# Altium schematic sheet FPGA_IO.SchDoc
size 863 x 558 mm; SheetNumber: 9; SheetTotal: 25; Sheet_Name: FPGA IO BANKS; Size: 11x17
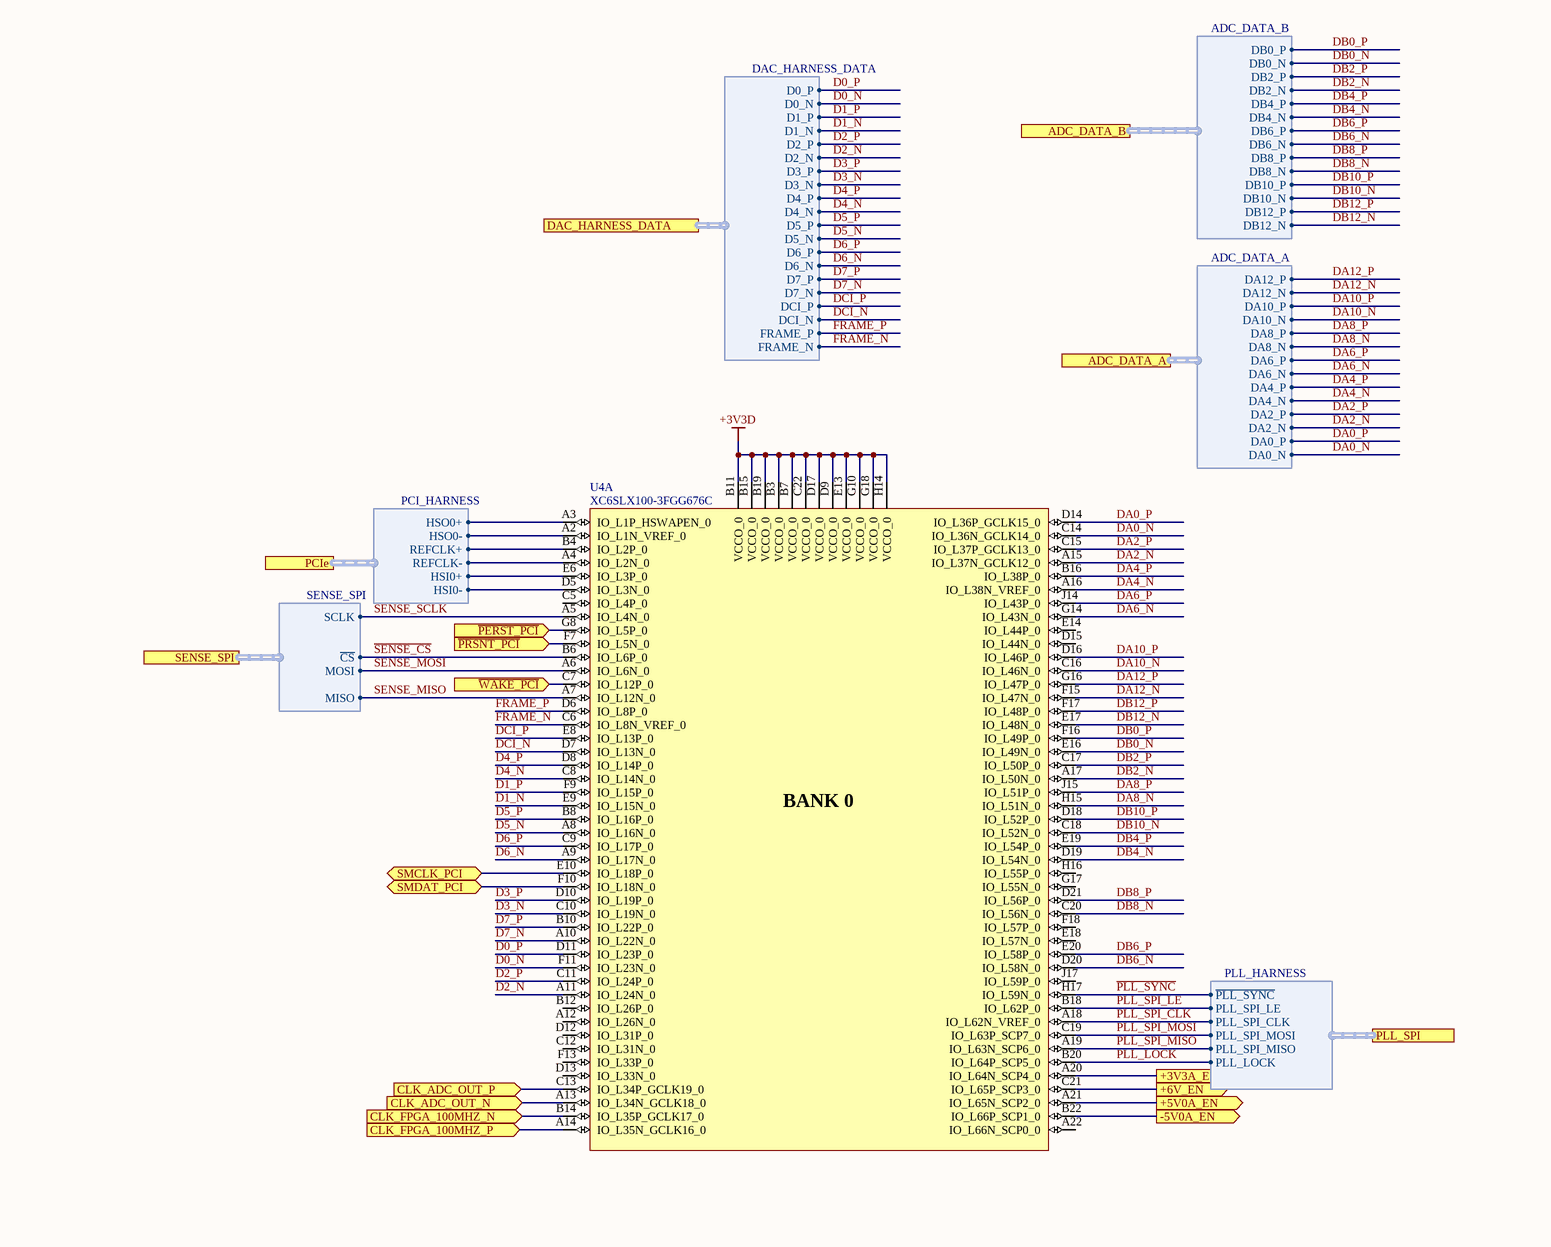
[diagram p0: FPGA_IO.SchDoc, top left]
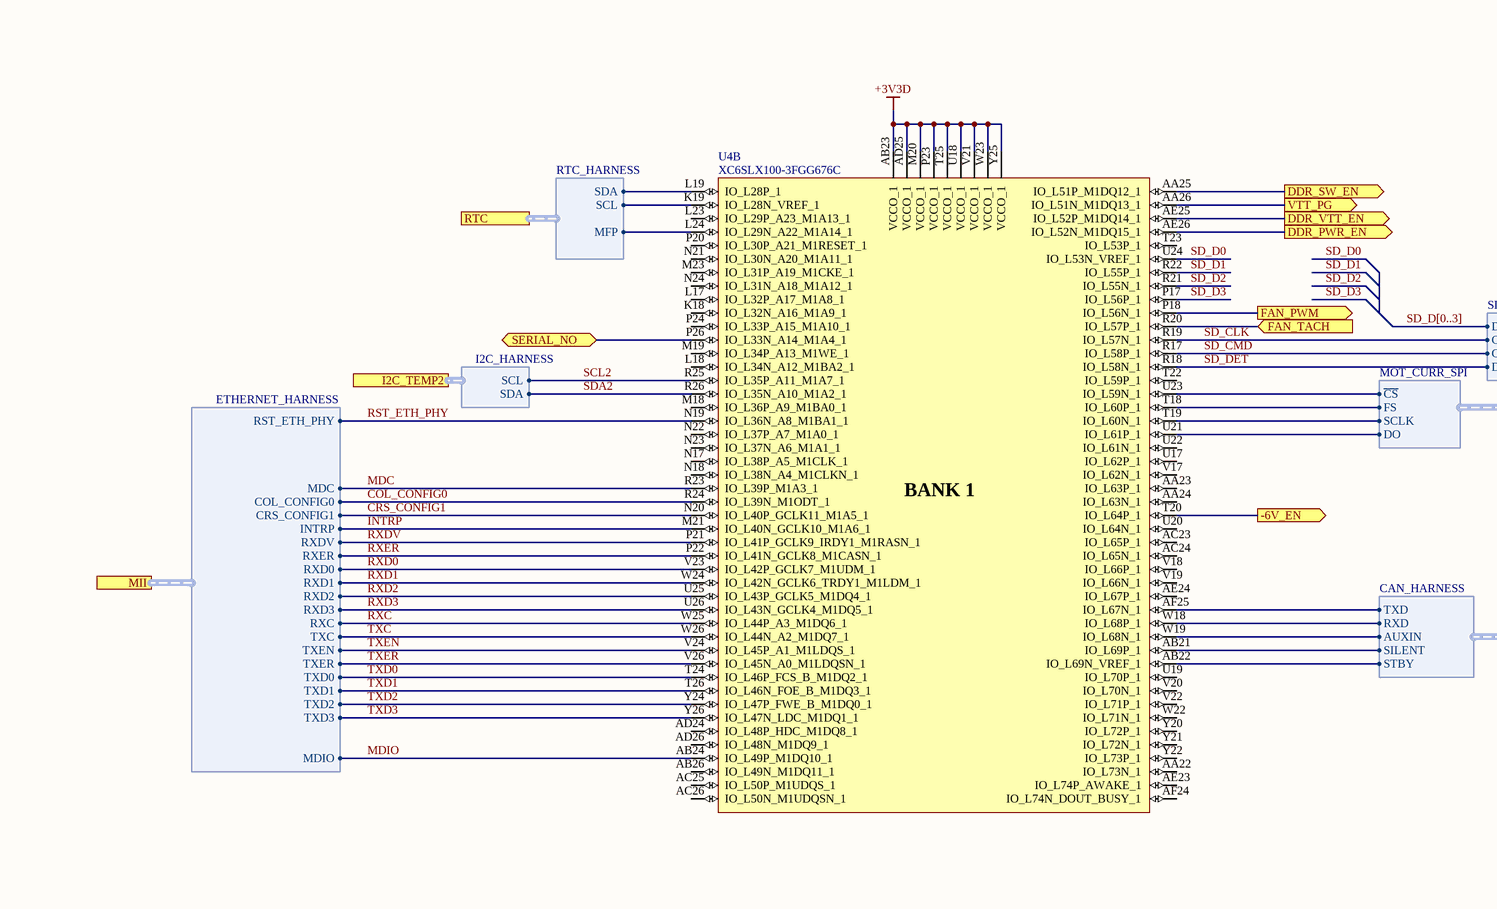
[diagram p1: FPGA_IO.SchDoc, top middle]
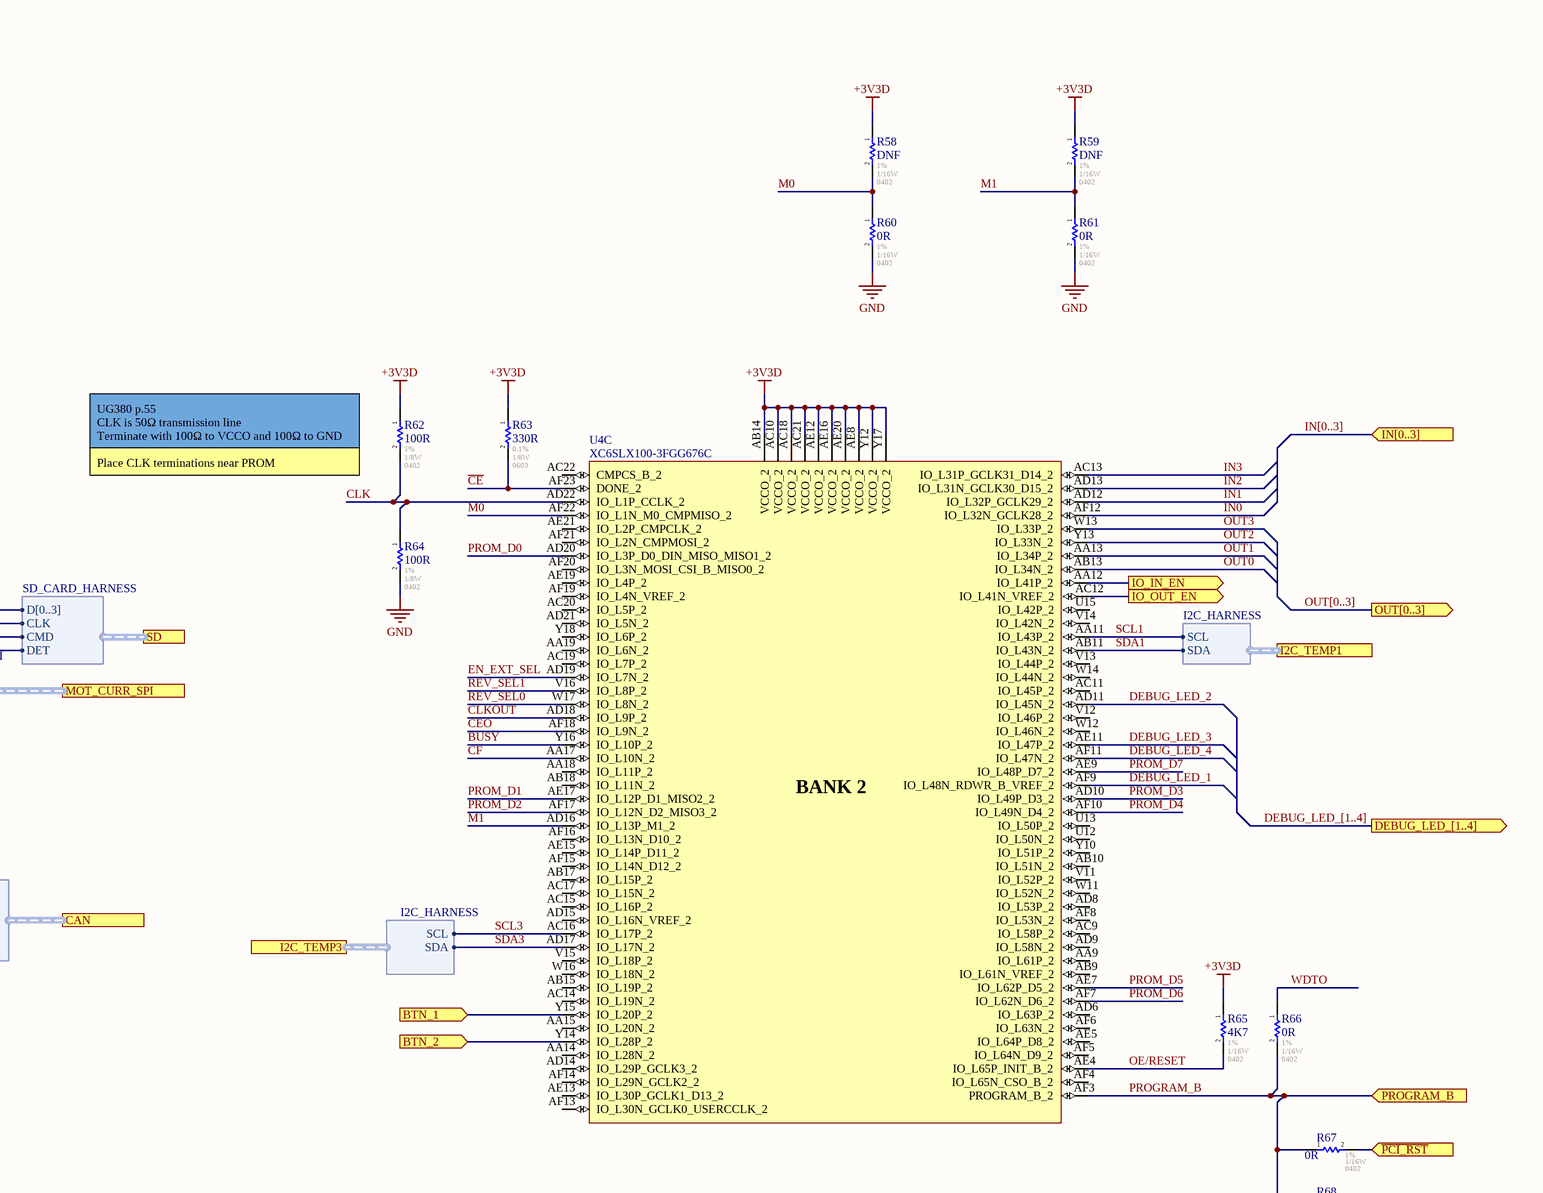
[diagram p2: FPGA_IO.SchDoc, top right]
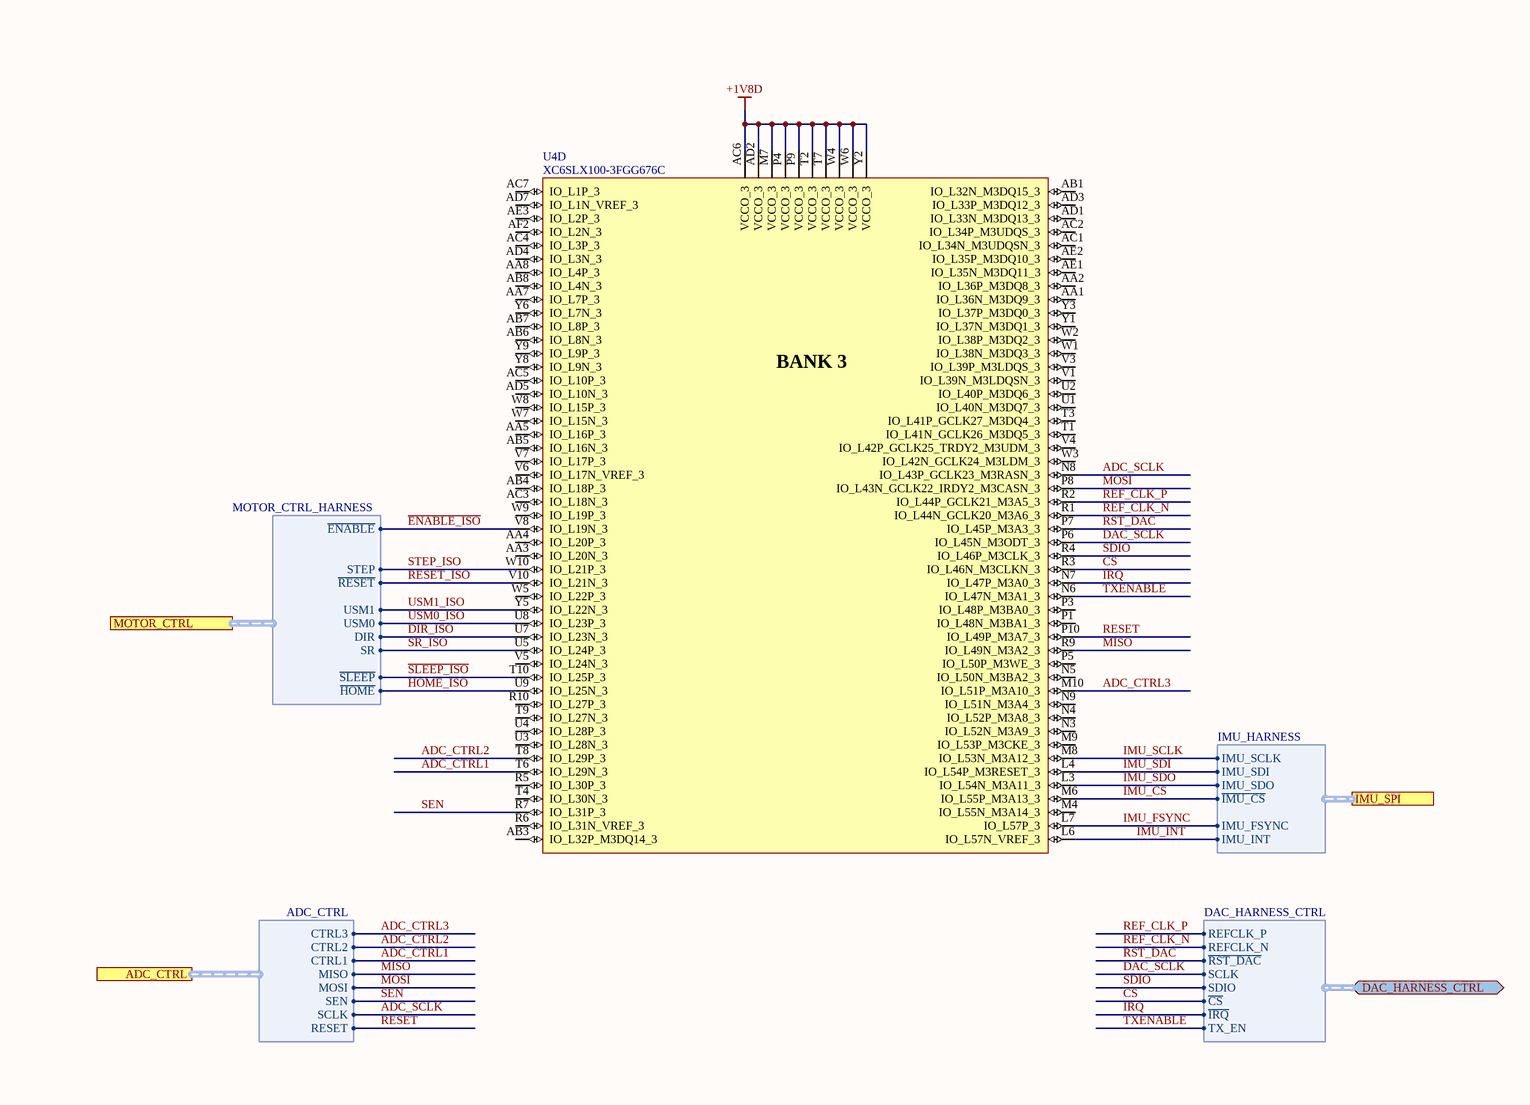
[diagram p3: FPGA_IO.SchDoc, bottom left]
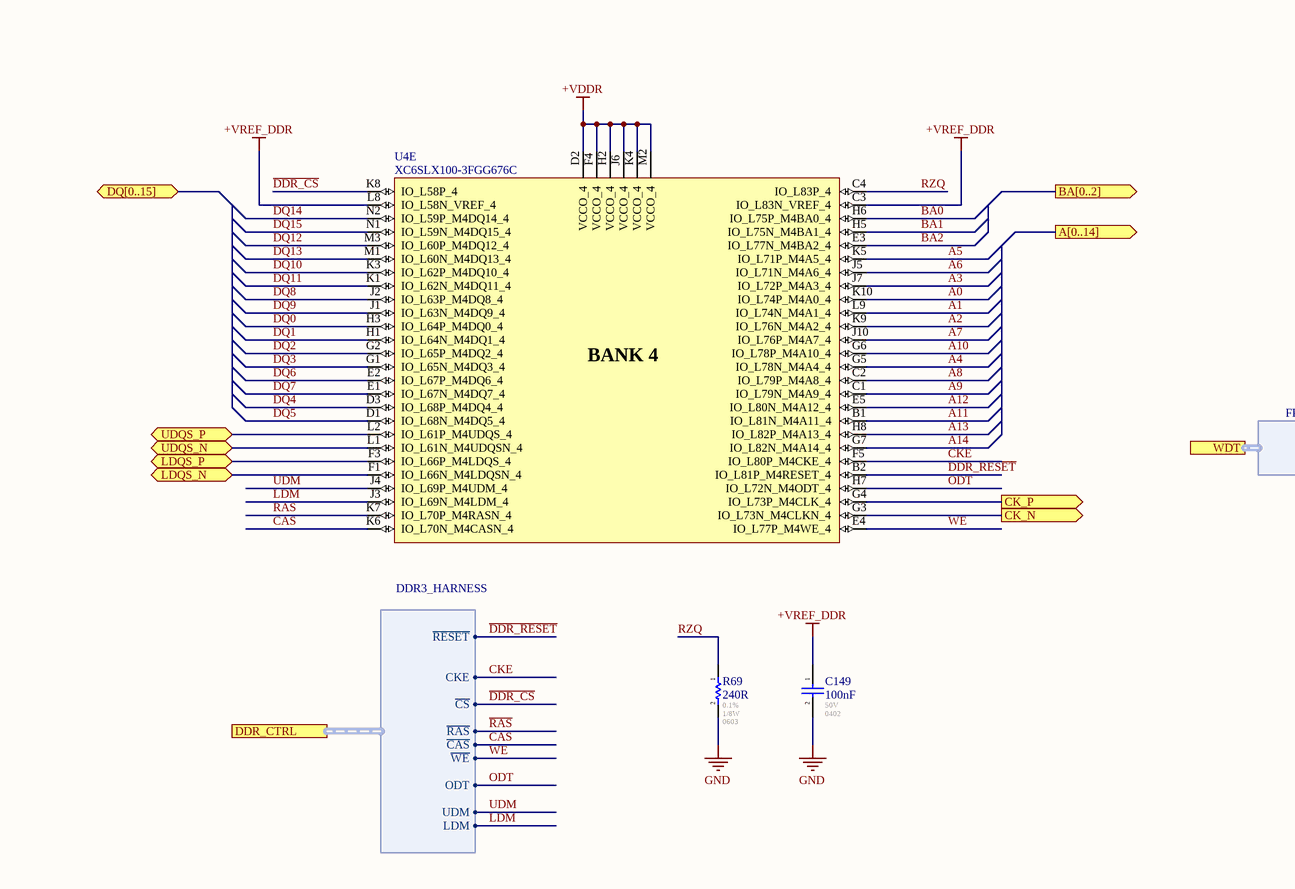
[diagram p4: FPGA_IO.SchDoc, bottom middle]
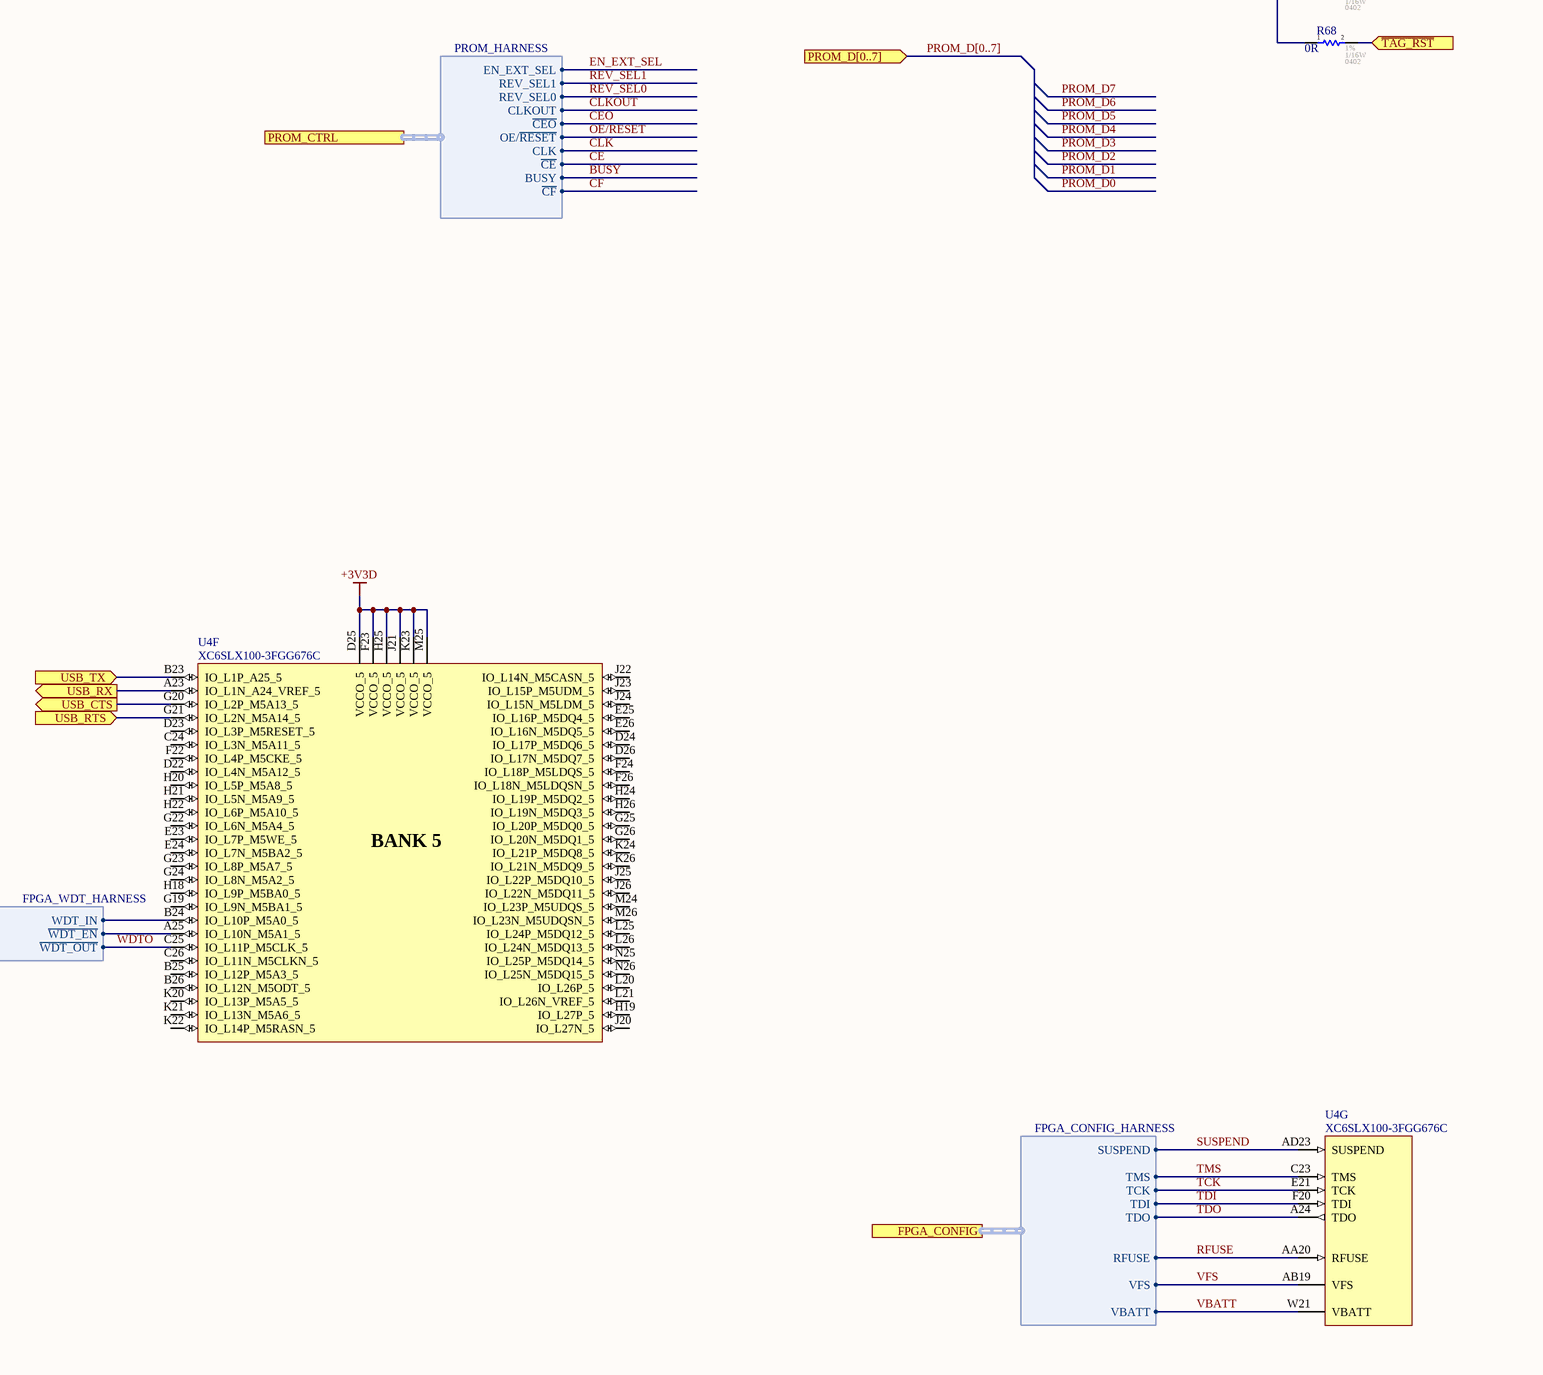
[diagram p5: FPGA_IO.SchDoc, bottom right]

## Parts
C149  100nF  Voltage - Rated: 50V  Footprint: 0402  [CAP_0402]
R58  DNF  Tolerance: 1%  Power: 1/16W  Package / Case: 0402  [RES_0402]
R59  DNF  Tolerance: 1%  Power: 1/16W  Package / Case: 0402  [RES_0402]
R60  0R  Tolerance: 1%  Power: 1/16W  Package / Case: 0402  [RES_0402]
R61  0R  Tolerance: 1%  Power: 1/16W  Package / Case: 0402  [RES_0402]
R62  100R  Tolerance: 1%  Power: 1/8W  Package / Case: 0402  [RES_0402]
R63  330R  Tolerance: 0.1%  Power: 1/8W  Package / Case: 0603  [RES_0603]
R64  100R  Tolerance: 1%  Power: 1/8W  Package / Case: 0402  [RES_0402]
R65  4K7  Tolerance: 1%  Power: 1/16W  Package / Case: 0402  [RES_0402]
R66  0R  Tolerance: 1%  Power: 1/16W  Package / Case: 0402  [RES_0402]
R67  0R  Tolerance: 1%  Power: 1/16W  Package / Case: 0402  [RES_0402]
R68  0R  Tolerance: 1%  Power: 1/16W  Package / Case: 0402  [RES_0402]
R69  240R  Tolerance: 0.1%  Power: 1/8W  Package / Case: 0603  [RES_0603]
U4  XC6SLX100-3FGG676C  [FPGA_XILINX_FGG676]  (parts A,B,C,D,E,F,G of 10)

## Ports
+3V3A_EN (out), +5V0A_EN (out), +6V_EN (out), -5V0A_EN (out), -6V_EN (out), A[0..14] (out), ADC_CTRL (harness ADC_CTRL), ADC_DATA_A (harness ADC_DATA_A), ADC_DATA_B (harness ADC_DATA_B), BA[0..2] (out), BTN_1 (in), BTN_2 (in), CAN (harness CAN_HARNESS), CK_N (out), CK_P (out), CLK_ADC_OUT_N (in), CLK_ADC_OUT_P (in), CLK_FPGA_100MHZ_N (in), CLK_FPGA_100MHZ_P (in), DAC_HARNESS_CTRL (bidir, harness DAC_HARNESS_CTRL), DAC_HARNESS_DATA (harness DAC_HARNESS_DATA), DDR_CTRL (harness DDR3_HARNESS), DDR_PWR_EN (out), DDR_SW_EN (out), DDR_VTT_EN (out), DEBUG_LED_[1..4] (out), DQ[0..15] (bidir), FAN_PWM (out), FAN_TACH (in), FPGA_CONFIG (harness FPGA_CONFIG_HARNESS), I2C_TEMP1 (harness I2C_HARNESS), I2C_TEMP2 (harness I2C_HARNESS), I2C_TEMP3 (harness I2C_HARNESS), IMU_SPI (harness IMU_HARNESS), IN[0..3] (in), IO_IN_EN (out), IO_OUT_EN (out), LDQS_N (bidir), LDQS_P (bidir), MII (harness ETHERNET_HARNESS), MOT_CURR_SPI (harness MOT_CURR_SPI), MOTOR_CTRL (harness MOTOR_CTRL_HARNESS), OUT[0..3] (out), PCIe (harness PCI_HARNESS), PLL_SPI (harness PLL_HARNESS), PROGRAM_B (in), PROM_CTRL (harness PROM_HARNESS), PROM_D[0..7] (in), RTC (harness RTC_HARNESS), SD (harness SD_CARD_HARNESS), SENSE_SPI (harness SENSE_SPI), SERIAL_NO (bidir), SMCLK_PCI (bidir), SMDAT_PCI (bidir), UDQS_N (bidir), UDQS_P (bidir), USB_CTS (out), USB_RTS (in), USB_RX (out), USB_TX (in), VTT_PG (out), WDT (harness FPGA_WDT_HARNESS), ~{PCI_RST} (in), ~{PERST_PCI} (in), ~{PRSNT_PCI} (in), ~{TAG_RST} (in), ~{WAKE_PCI} (in)

## Harnesses
DDR3_HARNESS: ~{RESET}, CKE, ~{CS}, ~{RAS}, ~{CAS}, ~{WE}, ODT, UDM, LDM
DAC_HARNESS_DATA: D0_N, D0_P, D1_P, D1_N, D2_P, D2_N, D3_P, D3_N, D4_P, D4_N, D5_P, D5_N, D6_P, D6_N, D7_P, D7_N, DCI_P, DCI_N, FRAME_P, FRAME_N
ADC_DATA_A: DA0_P, DA0_N, DA2_P, DA2_N, DA4_P, DA4_N, DA6_P, DA6_N, DA8_P, DA8_N, DA10_P, DA10_N, DA12_P, DA12_N
ADC_DATA_B: DB0_P, DB0_N, DB2_P, DB2_N, DB4_P, DB4_N, DB6_P, DB6_N, DB8_P, DB8_N, DB10_P, DB10_N, DB12_P, DB12_N
ADC_CTRL: RESET, SCLK, SEN, MOSI, MISO, CTRL1, CTRL2, CTRL3
PROM_HARNESS: EN_EXT_SEL, REV_SEL1, REV_SEL0, CLKOUT, ~{CEO}, OE/~{RESET}, CLK, ~{CE}, BUSY, ~{CF}
ETHERNET_HARNESS: MDIO, MDC, COL_CONFIG0, CRS_CONFIG1, INTRP, RXDV, RXER, RXD0, RXD1, RXD2, RXD3, RXC, TXEN, TXER, TXD0, TXD1, TXD2, TXD3, TXC, RST_ETH_PHY
MOTOR_CTRL_HARNESS: DIR, SR, STEP, ~{SLEEP}, ~{HOME}, USM1, USM0, ~{RESET}, ~{ENABLE}
PLL_HARNESS: ~{PLL_SYNC}, PLL_SPI_LE, PLL_SPI_CLK, PLL_SPI_MOSI, PLL_SPI_MISO, PLL_LOCK
FPGA_CONFIG_HARNESS: TCK, TDO, TDI, SUSPEND, TMS, RFUSE, VFS, VBATT
SENSE_SPI: ~{CS}, MISO, MOSI, SCLK
I2C_HARNESS: SDA, SCL
MOT_CURR_SPI: ~{CS}, FS, SCLK, DO
SD_CARD_HARNESS: CLK, CMD, D[0..3], DET
DAC_HARNESS_CTRL: ~{RST_DAC}, SCLK, SDIO, ~{CS}, ~{IRQ}, TX_EN, REFCLK_P, REFCLK_N
FPGA_WDT_HARNESS: WDT_IN, ~{WDT_EN}, ~{WDT_OUT}
PCI_HARNESS: HSI0+, HSI0-, HSO0+, HSO0-, REFCLK+, REFCLK-
CAN_HARNESS: TXD, RXD, AUXIN, SILENT, STBY
IMU_HARNESS: IMU_SCLK, IMU_SDI, IMU_SDO, ~{IMU_CS}, IMU_FSYNC, IMU_INT
RTC_HARNESS: SDA, SCL, MFP

## Nets
+1V8D: U4.AC6(VCCO_3) U4.AD2(VCCO_3) U4.M7(VCCO_3) U4.P4(VCCO_3) U4.P9(VCCO_3) U4.T2(VCCO_3) U4.T7(VCCO_3) U4.W4(VCCO_3) U4.W6(VCCO_3) U4.Y2(VCCO_3)
+3V3D: R58.1 R59.1 R62.1 R63.1 R65.1 U4.AB14(VCCO_2) U4.AB23(VCCO_1) U4.AC10(VCCO_2) U4.AC18(VCCO_2) U4.AC21(VCCO_2) U4.AD25(VCCO_1) U4.AE8(VCCO_2) U4.AE12(VCCO_2) U4.AE16(VCCO_2) U4.AE20(VCCO_2) U4.B3(VCCO_0) U4.B7(VCCO_0) U4.B11(VCCO_0) U4.B15(VCCO_0) U4.B19(VCCO_0) U4.C22(VCCO_0) U4.D9(VCCO_0) U4.D17(VCCO_0) U4.D25(VCCO_5) U4.E13(VCCO_0) U4.F23(VCCO_5) U4.G10(VCCO_0) U4.G18(VCCO_0) U4.H14(VCCO_0) U4.H25(VCCO_5) U4.J21(VCCO_5) U4.K23(VCCO_5) U4.M20(VCCO_1) U4.M25(VCCO_5) U4.P23(VCCO_1) U4.T25(VCCO_1) U4.U18(VCCO_1) U4.V21(VCCO_1) U4.W23(VCCO_1) U4.Y12(VCCO_2) U4.Y17(VCCO_2) U4.Y25(VCCO_1)
+VDDR: U4.D2(VCCO_4) U4.F4(VCCO_4) U4.H2(VCCO_4) U4.J6(VCCO_4) U4.K4(VCCO_4) U4.M2(VCCO_4)
+VREF_DDR: C149.1 U4.C3(IO_L83N_VREF_4) U4.L8(IO_L58N_VREF_4)
GND: C149.2 R60.2 R61.2 R64.2 R69.2
+3V3A_EN: U4.A20(IO_L64N_SCP4_0) ; port +3V3A_EN
+5V0A_EN: U4.A21(IO_L65N_SCP2_0) ; port +5V0A_EN
+6V_EN: U4.C21(IO_L65P_SCP3_0) ; port +6V_EN
-5V0A_EN: U4.B22(IO_L66P_SCP1_0) ; port -5V0A_EN
-6V_EN: U4.T20(IO_L64P_1) ; port -6V_EN
~{CAS}: U4.K6(IO_L70N_M4CASN_4) ; port DDR_CTRL.~{CAS}
~{CE}: R63.2 U4.AF23(DONE_2) ; port PROM_CTRL.~{CE}
~{CEO}: U4.AF18(IO_L9N_2) ; port PROM_CTRL.~{CEO}
~{CF}: U4.AA17(IO_L10N_2) ; port PROM_CTRL.~{CF}
~{CS}: U4.R3(IO_L46N_M3CLKN_3) ; port DAC_HARNESS_CTRL.~{CS}
~{DDR_CS}: U4.K8(IO_L58P_4) ; port DDR_CTRL.~{CS}
~{DDR_RESET}: U4.B2(IO_L81P_M4RESET_4) ; port DDR_CTRL.~{RESET}
~{ENABLE_ISO}: U4.V8(IO_L19N_3) ; port MOTOR_CTRL.~{ENABLE}
~{HOME_ISO}: U4.U9(IO_L25N_3) ; port MOTOR_CTRL.~{HOME}
~{IMU_CS}: U4.M6(IO_L55P_M3A13_3) ; port IMU_SPI.~{IMU_CS}
~{IRQ}: U4.N7(IO_L47P_M3A0_3) ; port DAC_HARNESS_CTRL.~{IRQ}
~{PCI_RST}: R67.2 ; port ~{PCI_RST}
~{PERST_PCI}: U4.G8(IO_L5P_0) ; port ~{PERST_PCI}
~{PLL_SYNC}: U4.H17(IO_L59N_0) ; port PLL_SPI.~{PLL_SYNC}
~{PRSNT_PCI}: U4.F7(IO_L5N_0) ; port ~{PRSNT_PCI}
~{RAS}: U4.K7(IO_L70P_M4RASN_4) ; port DDR_CTRL.~{RAS}
~{RESET_ISO}: U4.V10(IO_L21N_3) ; port MOTOR_CTRL.~{RESET}
~{RST_DAC}: U4.P7(IO_L45P_M3A3_3) ; port DAC_HARNESS_CTRL.~{RST_DAC}
~{SENSE_CS}: U4.B6(IO_L6P_0) ; port SENSE_SPI.~{CS}
~{SLEEP_ISO}: U4.T10(IO_L25P_3) ; port MOTOR_CTRL.~{SLEEP}
~{TAG_RST}: R68.2 ; port ~{TAG_RST}
~{WAKE_PCI}: U4.C7(IO_L12P_0) ; port ~{WAKE_PCI}
~{WE}: U4.E4(IO_L77P_M4WE_4) ; port DDR_CTRL.~{WE}
A0: U4.K10(IO_L74P_M4A0_4)
A1: U4.L9(IO_L74N_M4A1_4)
A2: U4.K9(IO_L76N_M4A2_4)
A3: U4.J7(IO_L72P_M4A3_4)
A4: U4.G5(IO_L78N_M4A4_4)
A5: U4.K5(IO_L71P_M4A5_4)
A6: U4.J5(IO_L71N_M4A6_4)
A7: U4.J10(IO_L76P_M4A7_4)
A8: U4.C2(IO_L79P_M4A8_4)
A9: U4.C1(IO_L79N_M4A9_4)
A10: U4.G6(IO_L78P_M4A10_4)
A11: U4.B1(IO_L81N_M4A11_4)
A12: U4.E5(IO_L80N_M4A12_4)
A13: U4.H8(IO_L82P_M4A13_4)
A14: U4.G7(IO_L82N_M4A14_4)
ADC_CTRL1: U4.T6(IO_L29N_3) ; port ADC_CTRL.CTRL1
ADC_CTRL2: U4.T8(IO_L29P_3) ; port ADC_CTRL.CTRL2
ADC_CTRL3: U4.M10(IO_L51P_M3A10_3) ; port ADC_CTRL.CTRL3
ADC_SCLK: U4.N8(IO_L43P_GCLK23_M3RASN_3) ; port ADC_CTRL.SCLK
BA0: U4.H6(IO_L75P_M4BA0_4)
BA1: U4.H5(IO_L75N_M4BA1_4)
BA2: U4.E3(IO_L77N_M4BA2_4)
BTN_1: U4.Y15(IO_L20P_2) ; port BTN_1
BTN_2: U4.Y14(IO_L28P_2) ; port BTN_2
BUSY: U4.Y16(IO_L10P_2) ; port PROM_CTRL.BUSY
CK_N: U4.G3(IO_L73N_M4CLKN_4) ; port CK_N
CK_P: U4.G4(IO_L73P_M4CLK_4) ; port CK_P
CKE: U4.F5(IO_L80P_M4CKE_4) ; port DDR_CTRL.CKE
CLK: R62.2 R64.1 U4.AD22(IO_L1P_CCLK_2) ; port PROM_CTRL.CLK
CLK_ADC_OUT_N: U4.A13(IO_L34N_GCLK18_0) ; port CLK_ADC_OUT_N
CLK_ADC_OUT_P: U4.C13(IO_L34P_GCLK19_0) ; port CLK_ADC_OUT_P
CLK_FPGA_100MHZ_N: U4.B14(IO_L35P_GCLK17_0) ; port CLK_FPGA_100MHZ_N
CLK_FPGA_100MHZ_P: U4.A14(IO_L35N_GCLK16_0) ; port CLK_FPGA_100MHZ_P
CLKOUT: U4.AD18(IO_L9P_2) ; port PROM_CTRL.CLKOUT
COL_CONFIG0: U4.R24(IO_L39N_M1ODT_1) ; port MII.COL_CONFIG0
CRS_CONFIG1: U4.N20(IO_L40P_GCLK11_M1A5_1) ; port MII.CRS_CONFIG1
D0_N: U4.F11(IO_L23N_0) ; port DAC_HARNESS_DATA.D0_N
D0_P: U4.D11(IO_L23P_0) ; port DAC_HARNESS_DATA.D0_P
D1_N: U4.E9(IO_L15N_0) ; port DAC_HARNESS_DATA.D1_N
D1_P: U4.F9(IO_L15P_0) ; port DAC_HARNESS_DATA.D1_P
D2_N: U4.A11(IO_L24N_0) ; port DAC_HARNESS_DATA.D2_N
D2_P: U4.C11(IO_L24P_0) ; port DAC_HARNESS_DATA.D2_P
D3_N: U4.C10(IO_L19N_0) ; port DAC_HARNESS_DATA.D3_N
D3_P: U4.D10(IO_L19P_0) ; port DAC_HARNESS_DATA.D3_P
D4_N: U4.C8(IO_L14N_0) ; port DAC_HARNESS_DATA.D4_N
D4_P: U4.D8(IO_L14P_0) ; port DAC_HARNESS_DATA.D4_P
D5_N: U4.A8(IO_L16N_0) ; port DAC_HARNESS_DATA.D5_N
D5_P: U4.B8(IO_L16P_0) ; port DAC_HARNESS_DATA.D5_P
D6_N: U4.A9(IO_L17N_0) ; port DAC_HARNESS_DATA.D6_N
D6_P: U4.C9(IO_L17P_0) ; port DAC_HARNESS_DATA.D6_P
D7_N: U4.A10(IO_L22N_0) ; port DAC_HARNESS_DATA.D7_N
D7_P: U4.B10(IO_L22P_0) ; port DAC_HARNESS_DATA.D7_P
DA0_N: U4.C14(IO_L36N_GCLK14_0) ; port ADC_DATA_A.DA0_N
DA0_P: U4.D14(IO_L36P_GCLK15_0) ; port ADC_DATA_A.DA0_P
DA2_N: U4.A15(IO_L37N_GCLK12_0) ; port ADC_DATA_A.DA2_N
DA2_P: U4.C15(IO_L37P_GCLK13_0) ; port ADC_DATA_A.DA2_P
DA4_N: U4.A16(IO_L38N_VREF_0) ; port ADC_DATA_A.DA4_N
DA4_P: U4.B16(IO_L38P_0) ; port ADC_DATA_A.DA4_P
DA6_N: U4.G14(IO_L43N_0) ; port ADC_DATA_A.DA6_N
DA6_P: U4.J14(IO_L43P_0) ; port ADC_DATA_A.DA6_P
DA8_N: U4.H15(IO_L51N_0) ; port ADC_DATA_A.DA8_N
DA8_P: U4.J15(IO_L51P_0) ; port ADC_DATA_A.DA8_P
DA10_N: U4.C16(IO_L46N_0) ; port ADC_DATA_A.DA10_N
DA10_P: U4.D16(IO_L46P_0) ; port ADC_DATA_A.DA10_P
DA12_N: U4.F15(IO_L47N_0) ; port ADC_DATA_A.DA12_N
DA12_P: U4.G16(IO_L47P_0) ; port ADC_DATA_A.DA12_P
DAC_SCLK: U4.P6(IO_L45N_M3ODT_3) ; port DAC_HARNESS_CTRL.SCLK
DB0_N: U4.E16(IO_L49N_0) ; port ADC_DATA_B.DB0_N
DB0_P: U4.F16(IO_L49P_0) ; port ADC_DATA_B.DB0_P
DB2_N: U4.A17(IO_L50N_0) ; port ADC_DATA_B.DB2_N
DB2_P: U4.C17(IO_L50P_0) ; port ADC_DATA_B.DB2_P
DB4_N: U4.D19(IO_L54N_0) ; port ADC_DATA_B.DB4_N
DB4_P: U4.E19(IO_L54P_0) ; port ADC_DATA_B.DB4_P
DB6_N: U4.D20(IO_L58N_0) ; port ADC_DATA_B.DB6_N
DB6_P: U4.E20(IO_L58P_0) ; port ADC_DATA_B.DB6_P
DB8_N: U4.C20(IO_L56N_0) ; port ADC_DATA_B.DB8_N
DB8_P: U4.D21(IO_L56P_0) ; port ADC_DATA_B.DB8_P
DB10_N: U4.C18(IO_L52N_0) ; port ADC_DATA_B.DB10_N
DB10_P: U4.D18(IO_L52P_0) ; port ADC_DATA_B.DB10_P
DB12_N: U4.E17(IO_L48N_0) ; port ADC_DATA_B.DB12_N
DB12_P: U4.F17(IO_L48P_0) ; port ADC_DATA_B.DB12_P
DCI_N: U4.D7(IO_L13N_0) ; port DAC_HARNESS_DATA.DCI_N
DCI_P: U4.E8(IO_L13P_0) ; port DAC_HARNESS_DATA.DCI_P
DDR_PWR_EN: U4.AE26(IO_L52N_M1DQ15_1) ; port DDR_PWR_EN
DDR_SW_EN: U4.AA25(IO_L51P_M1DQ12_1) ; port DDR_SW_EN
DDR_VTT_EN: U4.AE25(IO_L52P_M1DQ14_1) ; port DDR_VTT_EN
DEBUG_LED_1: U4.AF9(IO_L48N_RDWR_B_VREF_2)
DEBUG_LED_2: U4.AD11(IO_L45N_2)
DEBUG_LED_3: U4.AE11(IO_L47P_2)
DEBUG_LED_4: U4.AF11(IO_L47N_2)
DIR_ISO: U4.U7(IO_L23N_3) ; port MOTOR_CTRL.DIR
DQ0: U4.H3(IO_L64P_M4DQ0_4)
DQ1: U4.H1(IO_L64N_M4DQ1_4)
DQ2: U4.G2(IO_L65P_M4DQ2_4)
DQ3: U4.G1(IO_L65N_M4DQ3_4)
DQ4: U4.D3(IO_L68P_M4DQ4_4)
DQ5: U4.D1(IO_L68N_M4DQ5_4)
DQ6: U4.E2(IO_L67P_M4DQ6_4)
DQ7: U4.E1(IO_L67N_M4DQ7_4)
DQ8: U4.J2(IO_L63P_M4DQ8_4)
DQ9: U4.J1(IO_L63N_M4DQ9_4)
DQ10: U4.K3(IO_L62P_M4DQ10_4)
DQ11: U4.K1(IO_L62N_M4DQ11_4)
DQ12: U4.M3(IO_L60P_M4DQ12_4)
DQ13: U4.M1(IO_L60N_M4DQ13_4)
DQ14: U4.N2(IO_L59P_M4DQ14_4)
DQ15: U4.N1(IO_L59N_M4DQ15_4)
EN_EXT_SEL: U4.AD19(IO_L7N_2) ; port PROM_CTRL.EN_EXT_SEL
FAN_PWM: U4.P18(IO_L56N_1) ; port FAN_PWM
FAN_TACH: U4.R20(IO_L57P_1) ; port FAN_TACH
FRAME_N: U4.C6(IO_L8N_VREF_0) ; port DAC_HARNESS_DATA.FRAME_N
FRAME_P: U4.D6(IO_L8P_0) ; port DAC_HARNESS_DATA.FRAME_P
IMU_FSYNC: U4.L7(IO_L57P_3) ; port IMU_SPI.IMU_FSYNC
IMU_INT: U4.L6(IO_L57N_VREF_3) ; port IMU_SPI.IMU_INT
IMU_SCLK: U4.M8(IO_L53N_M3A12_3) ; port IMU_SPI.IMU_SCLK
IMU_SDI: U4.L4(IO_L54P_M3RESET_3) ; port IMU_SPI.IMU_SDI
IMU_SDO: U4.L3(IO_L54N_M3A11_3) ; port IMU_SPI.IMU_SDO
IN0: U4.AF12(IO_L32N_GCLK28_2)
IN1: U4.AD12(IO_L32P_GCLK29_2)
IN2: U4.AD13(IO_L31N_GCLK30_D15_2)
IN3: U4.AC13(IO_L31P_GCLK31_D14_2)
INTRP: U4.M21(IO_L40N_GCLK10_M1A6_1) ; port MII.INTRP
IO_IN_EN: U4.AA12(IO_L41P_2) ; port IO_IN_EN
IO_OUT_EN: U4.AC12(IO_L41N_VREF_2) ; port IO_OUT_EN
LDM: U4.J3(IO_L69N_M4LDM_4) ; port DDR_CTRL.LDM
LDQS_N: U4.F1(IO_L66N_M4LDQSN_4) ; port LDQS_N
LDQS_P: U4.F3(IO_L66P_M4LDQS_4) ; port LDQS_P
M0: R58.2 R60.1 U4.AF22(IO_L1N_M0_CMPMISO_2)
M1: R59.2 R61.1 U4.AD16(IO_L13P_M1_2)
MDC: U4.R23(IO_L39P_M1A3_1) ; port MII.MDC
MDIO: U4.AB24(IO_L49P_M1DQ10_1) ; port MII.MDIO
MISO: U4.R9(IO_L49N_M3A2_3) ; port ADC_CTRL.MISO
MOSI: U4.P8(IO_L43N_GCLK22_IRDY2_M3CASN_3) ; port ADC_CTRL.MOSI
ODT: U4.H7(IO_L72N_M4ODT_4) ; port DDR_CTRL.ODT
OE/RESET: R65.2 U4.AE4(IO_L65P_INIT_B_2) ; port PROM_CTRL.OE/~{RESET}
OUT0: U4.AB13(IO_L34N_2)
OUT1: U4.AA13(IO_L34P_2)
OUT2: U4.Y13(IO_L33N_2)
OUT3: U4.W13(IO_L33P_2)
PLL_LOCK: U4.B20(IO_L64P_SCP5_0) ; port PLL_SPI.PLL_LOCK
PLL_SPI_CLK: U4.A18(IO_L62N_VREF_0) ; port PLL_SPI.PLL_SPI_CLK
PLL_SPI_LE: U4.B18(IO_L62P_0) ; port PLL_SPI.PLL_SPI_LE
PLL_SPI_MISO: U4.A19(IO_L63N_SCP6_0) ; port PLL_SPI.PLL_SPI_MISO
PLL_SPI_MOSI: U4.C19(IO_L63P_SCP7_0) ; port PLL_SPI.PLL_SPI_MOSI
PROGRAM_B: R66.2 R67.1 R68.1 U4.AF3(PROGRAM_B_2) ; port PROGRAM_B
PROM_D0: U4.AD20(IO_L3P_D0_DIN_MISO_MISO1_2)
PROM_D1: U4.AE17(IO_L12P_D1_MISO2_2)
PROM_D2: U4.AF17(IO_L12N_D2_MISO3_2)
PROM_D3: U4.AD10(IO_L49P_D3_2)
PROM_D4: U4.AF10(IO_L49N_D4_2)
PROM_D5: U4.AE7(IO_L62P_D5_2)
PROM_D6: U4.AF7(IO_L62N_D6_2)
PROM_D7: U4.AE9(IO_L48P_D7_2)
REF_CLK_N: U4.R1(IO_L44N_GCLK20_M3A6_3) ; port DAC_HARNESS_CTRL.REFCLK_N
REF_CLK_P: U4.R2(IO_L44P_GCLK21_M3A5_3) ; port DAC_HARNESS_CTRL.REFCLK_P
RESET: U4.P10(IO_L49P_M3A7_3) ; port ADC_CTRL.RESET
REV_SEL0: U4.W17(IO_L8N_2) ; port PROM_CTRL.REV_SEL0
REV_SEL1: U4.V16(IO_L8P_2) ; port PROM_CTRL.REV_SEL1
RFUSE: U4.AA20(RFUSE) ; port FPGA_CONFIG.RFUSE
RST_ETH_PHY: U4.N19(IO_L36N_A8_M1BA1_1) ; port MII.RST_ETH_PHY
RXC: U4.W25(IO_L44P_A3_M1DQ6_1) ; port MII.RXC
RXD0: U4.V23(IO_L42P_GCLK7_M1UDM_1) ; port MII.RXD0
RXD1: U4.W24(IO_L42N_GCLK6_TRDY1_M1LDM_1) ; port MII.RXD1
RXD2: U4.U25(IO_L43P_GCLK5_M1DQ4_1) ; port MII.RXD2
RXD3: U4.U26(IO_L43N_GCLK4_M1DQ5_1) ; port MII.RXD3
RXDV: U4.P21(IO_L41P_GCLK9_IRDY1_M1RASN_1) ; port MII.RXDV
RXER: U4.P22(IO_L41N_GCLK8_M1CASN_1) ; port MII.RXER
RZQ: R69.1 U4.C4(IO_L83P_4)
SCL1: U4.AA11(IO_L43P_2) ; port I2C_TEMP1.SCL
SCL2: U4.R25(IO_L35P_A11_M1A7_1) ; port I2C_TEMP2.SCL
SCL3: U4.AC16(IO_L17P_2) ; port I2C_TEMP3.SCL
SD_CLK: U4.R19(IO_L57N_1) ; port SD.CLK
SD_CMD: U4.R17(IO_L58P_1) ; port SD.CMD
SD_D0: U4.U24(IO_L53N_VREF_1)
SD_D1: U4.R22(IO_L55P_1)
SD_D2: U4.R21(IO_L55N_1)
SD_D3: U4.P17(IO_L56P_1)
SD_DET: U4.R18(IO_L58N_1) ; port SD.DET
SDA1: U4.AB11(IO_L43N_2) ; port I2C_TEMP1.SDA
SDA2: U4.R26(IO_L35N_A10_M1A2_1) ; port I2C_TEMP2.SDA
SDA3: U4.AD17(IO_L17N_2) ; port I2C_TEMP3.SDA
SDIO: U4.R4(IO_L46P_M3CLK_3) ; port DAC_HARNESS_CTRL.SDIO
SEN: U4.R7(IO_L31P_3) ; port ADC_CTRL.SEN
SENSE_MISO: U4.A7(IO_L12N_0) ; port SENSE_SPI.MISO
SENSE_MOSI: U4.A6(IO_L6N_0) ; port SENSE_SPI.MOSI
SENSE_SCLK: U4.A5(IO_L4N_0) ; port SENSE_SPI.SCLK
SERIAL_NO: U4.P26(IO_L33N_A14_M1A4_1) ; port SERIAL_NO
SMCLK_PCI: U4.E10(IO_L18P_0) ; port SMCLK_PCI
SMDAT_PCI: U4.F10(IO_L18N_0) ; port SMDAT_PCI
SR_ISO: U4.U5(IO_L24P_3) ; port MOTOR_CTRL.SR
STEP_ISO: U4.W10(IO_L21P_3) ; port MOTOR_CTRL.STEP
SUSPEND: U4.AD23(SUSPEND) ; port FPGA_CONFIG.SUSPEND
TCK: U4.E21(TCK) ; port FPGA_CONFIG.TCK
TDI: U4.F20(TDI) ; port FPGA_CONFIG.TDI
TDO: U4.A24(TDO) ; port FPGA_CONFIG.TDO
TMS: U4.C23(TMS) ; port FPGA_CONFIG.TMS
TXC: U4.W26(IO_L44N_A2_M1DQ7_1) ; port MII.TXC
TXD0: U4.T24(IO_L46P_FCS_B_M1DQ2_1) ; port MII.TXD0
TXD1: U4.T26(IO_L46N_FOE_B_M1DQ3_1) ; port MII.TXD1
TXD2: U4.Y24(IO_L47P_FWE_B_M1DQ0_1) ; port MII.TXD2
TXD3: U4.Y26(IO_L47N_LDC_M1DQ1_1) ; port MII.TXD3
TXEN: U4.V24(IO_L45P_A1_M1LDQS_1) ; port MII.TXEN
TXENABLE: U4.N6(IO_L47N_M3A1_3) ; port DAC_HARNESS_CTRL.TX_EN
TXER: U4.V26(IO_L45N_A0_M1LDQSN_1) ; port MII.TXER
UDM: U4.J4(IO_L69P_M4UDM_4) ; port DDR_CTRL.UDM
UDQS_N: U4.L1(IO_L61N_M4UDQSN_4) ; port UDQS_N
UDQS_P: U4.L2(IO_L61P_M4UDQS_4) ; port UDQS_P
USB_CTS: U4.G20(IO_L2P_M5A13_5) ; port USB_CTS
USB_RTS: U4.G21(IO_L2N_M5A14_5) ; port USB_RTS
USB_RX: U4.A23(IO_L1N_A24_VREF_5) ; port USB_RX
USB_TX: U4.B23(IO_L1P_A25_5) ; port USB_TX
USM0_ISO: U4.U8(IO_L23P_3) ; port MOTOR_CTRL.USM0
USM1_ISO: U4.Y5(IO_L22N_3) ; port MOTOR_CTRL.USM1
VBATT: U4.W21(VBATT) ; port FPGA_CONFIG.VBATT
VFS: U4.AB19(VFS) ; port FPGA_CONFIG.VFS
VTT_PG: U4.AA26(IO_L51N_M1DQ13_1) ; port VTT_PG
WDTO: R66.1 U4.C25(IO_L11P_M5CLK_5) ; port WDT.~{WDT_OUT}
NetU4_A2: U4.A2(IO_L1N_VREF_0) ; port PCIe.HSO0-
NetU4_A3: U4.A3(IO_L1P_HSWAPEN_0) ; port PCIe.HSO0+
NetU4_A4: U4.A4(IO_L2N_0) ; port PCIe.REFCLK-
NetU4_A25: U4.A25(IO_L10N_M5A1_5) ; port WDT.~{WDT_EN}
NetU4_AB21: U4.AB21(IO_L69P_1) ; port CAN.SILENT
NetU4_AB22: U4.AB22(IO_L69N_VREF_1) ; port CAN.STBY
NetU4_AF25: U4.AF25(IO_L67N_1) ; port CAN.TXD
NetU4_B4: U4.B4(IO_L2P_0) ; port PCIe.REFCLK+
NetU4_B24: U4.B24(IO_L10P_M5A0_5) ; port WDT.WDT_IN
NetU4_D5: U4.D5(IO_L3N_0) ; port PCIe.HSI0-
NetU4_E6: U4.E6(IO_L3P_0) ; port PCIe.HSI0+
NetU4_K19: U4.K19(IO_L28N_VREF_1) ; port RTC.SCL
NetU4_L19: U4.L19(IO_L28P_1) ; port RTC.SDA
NetU4_L24: U4.L24(IO_L29N_A22_M1A14_1) ; port RTC.MFP
NetU4_T18: U4.T18(IO_L60P_1) ; port MOT_CURR_SPI.FS
NetU4_T19: U4.T19(IO_L60N_1) ; port MOT_CURR_SPI.SCLK
NetU4_U21: U4.U21(IO_L61P_1) ; port MOT_CURR_SPI.DO
NetU4_U23: U4.U23(IO_L59N_1) ; port MOT_CURR_SPI.~{CS}
NetU4_W18: U4.W18(IO_L68P_1) ; port CAN.RXD
NetU4_W19: U4.W19(IO_L68N_1) ; port CAN.AUXIN

Not connected (* = marked no-connect by the designer): U4 A12(IO_L26N_0) A22(IO_L66N_SCP0_0) AA1(IO_L36N_M3DQ9_3) AA2(IO_L36P_M3DQ8_3) AA3(IO_L20N_3) AA4(IO_L20P_3) AA5(IO_L16P_3) AA7(IO_L7P_3) AA8(IO_L4P_3) AA9(IO_L61P_2) AA14(IO_L28N_2) AA15(IO_L20N_2) AA18(IO_L11P_2) AA19(IO_L6N_2) AA22(IO_L73N_1) AA23(IO_L63P_1) AA24(IO_L63N_1) AB1(IO_L32N_M3DQ15_3) AB3(IO_L32P_M3DQ14_3) AB4(IO_L18P_3) AB5(IO_L16N_3) AB6(IO_L8N_3) AB7(IO_L8P_3) AB8(IO_L4N_3) AB9(IO_L61N_VREF_2) AB10(IO_L51N_2) AB15(IO_L19P_2) AB17(IO_L15P_2) AB18(IO_L11N_2) AB26(IO_L49N_M1DQ11_1) AC1(IO_L34N_M3UDQSN_3) AC2(IO_L34P_M3UDQS_3) AC3(IO_L18N_3) AC4(IO_L3P_3) AC5(IO_L10P_3) AC7(IO_L1P_3) AC9(IO_L58P_2) AC11(IO_L45P_2) AC14(IO_L19N_2) AC15(IO_L16P_2) AC17(IO_L15N_2) AC19(IO_L7P_2) AC20(IO_L5P_2) AC22(CMPCS_B_2) AC23(IO_L65P_1) AC24(IO_L65N_1) AC25(IO_L50P_M1UDQS_1) AC26(IO_L50N_M1UDQSN_1) AD1(IO_L33N_M3DQ13_3) AD3(IO_L33P_M3DQ12_3) AD4(IO_L3N_3) AD5(IO_L10N_3) AD6(IO_L63P_2) AD7(IO_L1N_VREF_3) AD8(IO_L53P_2) AD9(IO_L58N_2) AD14(IO_L29P_GCLK3_2) AD15(IO_L16N_VREF_2) AD21(IO_L5N_2) AD24(IO_L48P_HDC_M1DQ8_1) AD26(IO_L48N_M1DQ9_1) AE1(IO_L35N_M3DQ11_3) AE2(IO_L35P_M3DQ10_3) AE3(IO_L2P_3) AE5(IO_L64P_D8_2) AE13(IO_L30P_GCLK1_D13_2) AE15(IO_L14P_D11_2) AE19(IO_L4P_2) AE21(IO_L2P_CMPCLK_2) AE23(IO_L74P_AWAKE_1) AE24(IO_L67P_1) AF2(IO_L2N_3) AF4(IO_L65N_CSO_B_2) AF5(IO_L64N_D9_2) AF6(IO_L63N_2) AF8(IO_L53N_2) AF13(IO_L30N_GCLK0_USERCCLK_2) AF14(IO_L29N_GCLK2_2) AF15(IO_L14N_D12_2) AF16(IO_L13N_D10_2) AF19(IO_L4N_VREF_2) AF20(IO_L3N_MOSI_CSI_B_MISO0_2) AF21(IO_L2N_CMPMOSI_2) AF24(IO_L74N_DOUT_BUSY_1) B12(IO_L26P_0) B25(IO_L12P_M5A3_5) B26(IO_L12N_M5ODT_5) C5(IO_L4P_0) C12(IO_L31N_0) C24(IO_L3N_M5A11_5) C26(IO_L11N_M5CLKN_5) D12(IO_L31P_0) D13(IO_L33N_0) D15(IO_L44N_0) D22(IO_L4N_M5A12_5) D23(IO_L3P_M5RESET_5) D24(IO_L17P_M5DQ6_5) D26(IO_L17N_M5DQ7_5) E14(IO_L44P_0) E18(IO_L57N_0) E23(IO_L7P_M5WE_5) E24(IO_L7N_M5BA2_5) E25(IO_L16P_M5DQ4_5) E26(IO_L16N_M5DQ5_5) F13(IO_L33P_0) F18(IO_L57P_0) F22(IO_L4P_M5CKE_5) F24(IO_L18P_M5LDQS_5) F26(IO_L18N_M5LDQSN_5) G17(IO_L55N_0) G19(IO_L9N_M5BA1_5) G22(IO_L6N_M5A4_5) G23(IO_L8P_M5A7_5) G24(IO_L8N_M5A2_5) G25(IO_L20P_M5DQ0_5) G26(IO_L20N_M5DQ1_5) H16(IO_L55P_0) H18(IO_L9P_M5BA0_5) H19(IO_L27P_5) H20(IO_L5P_M5A8_5) H21(IO_L5N_M5A9_5) H22(IO_L6P_M5A10_5) H24(IO_L19P_M5DQ2_5) H26(IO_L19N_M5DQ3_5) J17(IO_L59P_0) J20(IO_L27N_5) J22(IO_L14N_M5CASN_5) J23(IO_L15P_M5UDM_5) J24(IO_L15N_M5LDM_5) J25(IO_L22P_M5DQ10_5) J26(IO_L22N_M5DQ11_5) K18(IO_L32N_A16_M1A9_1) K20(IO_L13P_M5A5_5) K21(IO_L13N_M5A6_5) K22(IO_L14P_M5RASN_5) K24(IO_L21P_M5DQ8_5) K26(IO_L21N_M5DQ9_5) L17(IO_L32P_A17_M1A8_1) L18(IO_L34N_A12_M1BA2_1) L20(IO_L26P_5) L21(IO_L26N_VREF_5) L23(IO_L29P_A23_M1A13_1) L25(IO_L24P_M5DQ12_5) L26(IO_L24N_M5DQ13_5) M4(IO_L55N_M3A14_3) M9(IO_L53P_M3CKE_3) M18(IO_L36P_A9_M1BA0_1) M19(IO_L34P_A13_M1WE_1) M23(IO_L31P_A19_M1CKE_1) M24(IO_L23P_M5UDQS_5) M26(IO_L23N_M5UDQSN_5) N3(IO_L52N_M3A9_3) N4(IO_L52P_M3A8_3) N5(IO_L50N_M3BA2_3) N9(IO_L51N_M3A4_3) N17(IO_L38P_A5_M1CLK_1) N18(IO_L38N_A4_M1CLKN_1) N21(IO_L30N_A20_M1A11_1) N22(IO_L37P_A7_M1A0_1) N23(IO_L37N_A6_M1A1_1) N24(IO_L31N_A18_M1A12_1) N25(IO_L25P_M5DQ14_5) N26(IO_L25N_M5DQ15_5) P1(IO_L48N_M3BA1_3) P3(IO_L48P_M3BA0_3) P5(IO_L50P_M3WE_3) P20(IO_L30P_A21_M1RESET_1) P24(IO_L33P_A15_M1A10_1) R5(IO_L30P_3) R6(IO_L31N_VREF_3) R10(IO_L27P_3) T1(IO_L41N_GCLK26_M3DQ5_3) T3(IO_L41P_GCLK27_M3DQ4_3) T4(IO_L30N_3) T9(IO_L27N_3) T22(IO_L59P_1) T23(IO_L53P_1) U1(IO_L40N_M3DQ7_3) U2(IO_L40P_M3DQ6_3) U3(IO_L28N_3) U4(IO_L28P_3) U12(IO_L50N_2) U13(IO_L50P_2) U15(IO_L42P_2) U17(IO_L62P_1) U19(IO_L70P_1) U20(IO_L64N_1) U22(IO_L61N_1) V1(IO_L39N_M3LDQSN_3) V3(IO_L39P_M3LDQS_3) V4(IO_L42P_GCLK25_TRDY2_M3UDM_3) V5(IO_L24N_3) V6(IO_L17N_VREF_3) V7(IO_L17P_3) V11(IO_L52P_2) V12(IO_L46P_2) V13(IO_L44P_2) V14(IO_L42N_2) V15(IO_L18P_2) V17(IO_L62N_1) V18(IO_L66P_1) V19(IO_L66N_1) V20(IO_L70N_1) V22(IO_L71P_1) W1(IO_L38N_M3DQ3_3) W2(IO_L38P_M3DQ2_3) W3(IO_L42N_GCLK24_M3LDM_3) W5(IO_L22P_3) W7(IO_L15N_3) W8(IO_L15P_3) W9(IO_L19P_3) W11(IO_L52N_2) W12(IO_L46N_2) W14(IO_L44N_2) W16(IO_L18N_2) W22(IO_L71N_1) Y1(IO_L37N_M3DQ1_3) Y3(IO_L37P_M3DQ0_3) Y6(IO_L7N_3) Y8(IO_L9N_3) Y9(IO_L9P_3) Y10(IO_L51P_2) Y18(IO_L6P_2) Y20(IO_L72P_1) Y21(IO_L72N_1) Y22(IO_L73P_1)

## Buses and harness runs
bus DEBUG_LED_[1..4] = port DEBUG_LED_[1..4]
bus IN[0..3] = port IN[0..3]
bus OUT[0..3] = port OUT[0..3]
bus PROM_D[0..7] = port PROM_D[0..7]
bus SD_D[0..3]

## Notes on the sheet
- (near R62) UG380 p.55
  CLK is 50Ω transmission line
  Terminate with 100Ω to VCCO and 100Ω to GND
- (near R62) Place CLK terminations near PROM
- Sheet Name
- Project Title
- Global Project
- Revision
- Size
- Date
- Group
- Sheet
- of
- Filename
- Designers
- (in symbol FPGA_XC6SLX100-3FGG676C, part A) BANK 0
- (in symbol FPGA_XC6SLX100-3FGG676C, part B) BANK 1
- (in symbol FPGA_XC6SLX100-3FGG676C, part C) BANK 2
- (in symbol FPGA_XC6SLX100-3FGG676C, part D) BANK 3
- (in symbol FPGA_XC6SLX100-3FGG676C, part E) BANK 4
- (in symbol FPGA_XC6SLX100-3FGG676C, part F) BANK 5

## Library data of the parts
C149 = CAP_CER: GCM155R71H104KE02J / 0402 100nF 10% X7R Ceramic Capacitor; Mfr: Murata; Operating Temperature: -55C - 125C; Temperature Coefficient: X7R; ComponentLink1Description: Digikey; ComponentLink1URL: [Digikey Link]; Part#: GCM155R71H104KE02J; ComponentLink2Description: Datasheet; ComponentLink2URL: [Datasheet Link]; Tolerance: 10%; Ratings: AEC-Q200
R58-R62 R64-R69 = RESISTOR: Automotive: AEC-Q200; Operating Temperature: *; # Digikey: *; ComponentLink1Description: Digikey; ComponentLink1URL: *; # Manufacturer: *
R63 = RESISTOR: 1M 0603 1% 1/16W Resistor; Automotive: AEC-Q200; Operating Temperature: *; # Digikey: *; ComponentLink1Description: Digikey; ComponentLink1URL: *; # Manufacturer: *
U4 = FPGA_XC6SLX100-3FGG676C: FPGA - XILINX SPARTAN 6 480 I/O - BGA-676; Voltage: 1.14 V ~ 1.26 V; Current: *; Power: *; Mfg: Xilinx; Mfg Part Number: XC6SLX100-3FGG676C; HelpURL: https://www.xilinx.com/support/documentation/data_sheets/ds162.pdf; CreatedBy: Jonathan Bouchard; Temperature: 0°C ~ 85°C (TJ); Value: *; Precision: *; Package: BGA-676; Supplier 1: Digikey; Supplier Part Number 1: 122-1760-ND